# Altium schematic sheet 4  - Latching.SchDoc
size A4
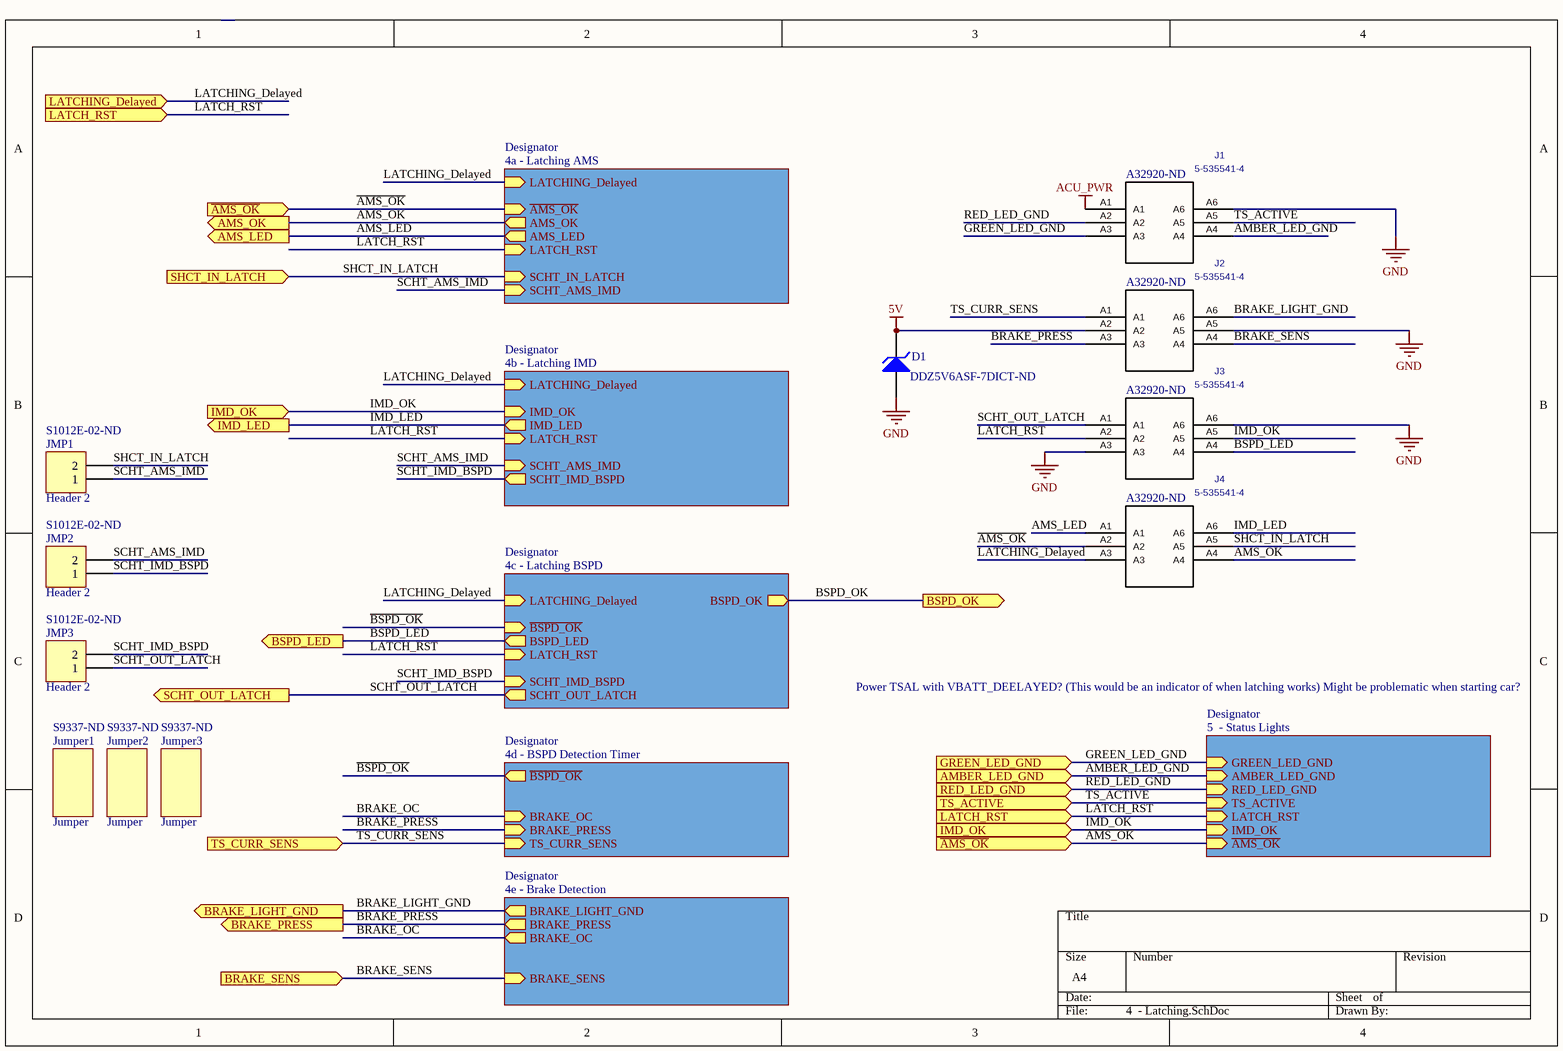
[diagram p0: 4  - Latching.SchDoc]

## Parts
D1  Supplier Part Number 1: DDZ5V6ASF-7DICT-ND  [DIODE_SOD323_101]  (hidden comment: D Zener)
J1  5-535541-4  Supplier Part Number 1: A32920-ND  [5-535541-4_5-535541-4(Primary)]
J2  5-535541-4  Supplier Part Number 1: A32920-ND  [5-535541-4_5-535541-4(Primary)]
J3  5-535541-4  Supplier Part Number 1: A32920-ND  [5-535541-4_5-535541-4(Primary)]
J4  5-535541-4  Supplier Part Number 1: A32920-ND  [5-535541-4_5-535541-4(Primary)]
JMP1  Header 2  Supplier Part Number 1: S1012E-02-ND  [2Pin Jumper]
JMP2  Header 2  Supplier Part Number 1: S1012E-02-ND  [2Pin Jumper]
JMP3  Header 2  Supplier Part Number 1: S1012E-02-ND  [2Pin Jumper]
Jumper1  Jumper  Supplier Part Number 1: S9337-ND
Jumper2  Jumper  Supplier Part Number 1: S9337-ND
Jumper3  Jumper  Supplier Part Number 1: S9337-ND

## Sub-sheets
Designator = 4b - Latching IMD: LATCHING_Delayed (in), IMD_LED (out), LATCH_RST (in), SCHT_AMS_IMD (in), SCHT_IMD_BSPD (out), IMD_OK (in)
Designator = 4c - Latching BSPD: LATCHING_Delayed (in), BSPD_LED (out), LATCH_RST (in), SCHT_IMD_BSPD (in), SCHT_OUT_LATCH (out), ~{BSPD_OK} (in), BSPD_OK (out)
Designator = 4a - Latching AMS: LATCHING_Delayed (in), ~{AMS_OK} (in), AMS_LED (out), LATCH_RST (in), SCHT_IN_LATCH (in), SCHT_AMS_IMD (in), AMS_OK (out)
Designator = 4d - BSPD Detection Timer: ~{BSPD_OK} (out), TS_CURR_SENS (in), BRAKE_PRESS (in), BRAKE_OC (in)
Designator = 4e - Brake Detection: BRAKE_LIGHT_GND (out), BRAKE_PRESS (out), BRAKE_SENS (in), BRAKE_OC (out)
Designator = 5  - Status Lights: RED_LED_GND (in), TS_ACTIVE (in), LATCH_RST (in), AMBER_LED_GND (in), GREEN_LED_GND (in), IMD_OK (in), ~{AMS_OK} (in)

## Ports
AMBER_LED_GND (in), AMS_LED (out), AMS_OK (out), BRAKE_LIGHT_GND (out), BRAKE_PRESS (out), BRAKE_SENS (in), BSPD_LED (out), BSPD_OK (out), GREEN_LED_GND (in), IMD_LED (out), IMD_OK (in), LATCH_RST (in), LATCHING_Delayed (in), RED_LED_GND (in), SCHT_OUT_LATCH (out), SHCT_IN_LATCH (in), TS_ACTIVE (in), TS_CURR_SENS (in), ~{AMS_OK} (in)

## Nets
5V: D1.2(K) J2.A2
ACU_PWR: J1.A1
GND: D1.1(A) J1.A6 J2.A5 J3.A3 J3.A6
~{AMS_OK}: J4.A2 ; port ~{AMS_OK}, sheet Designator/~{AMS_OK}, sheet Designator/~{AMS_OK}
AMBER_LED_GND: J1.A4 ; port AMBER_LED_GND, sheet Designator/AMBER_LED_GND
AMS_LED: J4.A1 ; port AMS_LED, sheet Designator/AMS_LED
AMS_OK: J4.A4 ; port AMS_OK, sheet Designator/AMS_OK
~{BSPD_OK}: sheet Designator/~{BSPD_OK}, sheet Designator/~{BSPD_OK}
BRAKE_LIGHT_GND: J2.A6 ; port BRAKE_LIGHT_GND, sheet Designator/BRAKE_LIGHT_GND
BRAKE_OC: sheet Designator/BRAKE_OC, sheet Designator/BRAKE_OC
BRAKE_PRESS: J2.A3 ; port BRAKE_PRESS, sheet Designator/BRAKE_PRESS, sheet Designator/BRAKE_PRESS
BRAKE_SENS: J2.A4 ; port BRAKE_SENS, sheet Designator/BRAKE_SENS
BSPD_LED: J3.A4 ; port BSPD_LED, sheet Designator/BSPD_LED
BSPD_OK: port BSPD_OK, sheet Designator/BSPD_OK
GREEN_LED_GND: J1.A3 ; port GREEN_LED_GND, sheet Designator/GREEN_LED_GND
IMD_LED: J4.A6 ; port IMD_LED, sheet Designator/IMD_LED
IMD_OK: J3.A5 ; port IMD_OK, sheet Designator/IMD_OK, sheet Designator/IMD_OK
LATCH_RST: J3.A2 ; port LATCH_RST, sheet Designator/LATCH_RST, sheet Designator/LATCH_RST, sheet Designator/LATCH_RST, sheet Designator/LATCH_RST
LATCHING_Delayed: J4.A3 ; port LATCHING_Delayed, sheet Designator/LATCHING_Delayed, sheet Designator/LATCHING_Delayed, sheet Designator/LATCHING_Delayed
RED_LED_GND: J1.A2 ; port RED_LED_GND, sheet Designator/RED_LED_GND
SCHT_AMS_IMD: JMP1.1 JMP2.2 ; sheet Designator/SCHT_AMS_IMD, sheet Designator/SCHT_AMS_IMD
SCHT_IMD_BSPD: JMP2.1 JMP3.2 ; sheet Designator/SCHT_IMD_BSPD, sheet Designator/SCHT_IMD_BSPD
SCHT_OUT_LATCH: J3.A1 JMP3.1 ; port SCHT_OUT_LATCH, sheet Designator/SCHT_OUT_LATCH
SHCT_IN_LATCH: J4.A5 JMP1.2 ; port SHCT_IN_LATCH, sheet Designator/SCHT_IN_LATCH
TS_ACTIVE: J1.A5 ; port TS_ACTIVE, sheet Designator/TS_ACTIVE
TS_CURR_SENS: J2.A1 ; port TS_CURR_SENS, sheet Designator/TS_CURR_SENS

## Notes on the sheet
- Power TSAL with VBATT_DEELAYED? (This would be an indicator of when latching works) Might be problematic when starting car?

## Library data of the parts
D1 = D Zener: Zener Diode; Published: 8-Jun-2000; LatestRevisionDate: 17-Jul-2002; LatestRevisionNote: Re-released for DXP Platform.; PackageReference: DIODE-0.7; Publisher: Altium Limited; PackageDescription: Diode, Thru-Hole; 2 Leads; 0.7 in Pin Spacing; Supplier 1: Digi-Key
J1-J4 = 5-535541-4: C: Copyright (C) 2015 Accelerated Designs. All rights reserved; Vendor: TE Connectivity; Built_By: EMA_UL_Team; Value: 5-535541-4; Manufacturer_Part_Number: 5-535541-4; Supplier 1: Digi-Key
JMP1-JMP3 = Header 2: Header, 2-Pin; Manufacturer: Harwin Inc.; Manufacturer Part Number: M20-9990246; Connector Type: Header, Cuttable; Pitch - Mating: 0.100" (2.54mm); Style: Board to Board or Cable; Shrouding: Unshrouded; Number of Positions: 2; Number of Positions Loaded: All; Contact Length - Mating: 0.240" (6.10mm); Contact Length - Post: 0.118" (3.00mm); Overall Contact Length: 0.460" (11.68mm); Material Flammability Rating: UL94 V-0; Current Rating: 3A per Contact; Mated Stacking Heights: 10.04mm, 10.64mm, 11.04mm, 16.54mm; LatestRevisionDate: 17-Jul-2002; LatestRevisionNote: Re-released for DXP Platform.; Publisher: Altium Limited; RoHS: RoHS Compliant; Category: Connectors, Interconnects; Packaging: Bulk; Part Status: Active; Contact Type: Male Pin; Number of Rows: 1; Row Spacing - Mating: -; Mounting Type: Through Hole; Termination: Solder; Fastening Type: Push-Pull; Insulation Height: 0.100" (2.54mm); Contact Shape: Square; Contact Finish - Mating: Tin; Contact Finish Thickness - Mating: -; Contact Finish - Post: Tin; Contact Material: Brass; Insulation Material: Polyamide (PA6T), Nylon 6T; Features: -; Operating Temperature: -40°C ~ 105°C; Ingress Protection: -; Insulation Color: Black; Voltage Rating: -; Contact Finish Thickness - Post: -; Applications: -; ComponentLink1URL: https://cdn.harwin.com/pdfs/M20-999.pdf; ComponentLink1Description: https://cdn.harwin.com/pdfs/M20-999.pdf; Supplier 1: Digi-Key
Jumper1-Jumper3 = Jumper: Supplier 1: Digi-Key